# EAGLE design GPS_radiologger_v20_CAM_M8Q_Programmer (EAGLE 9.6.2)
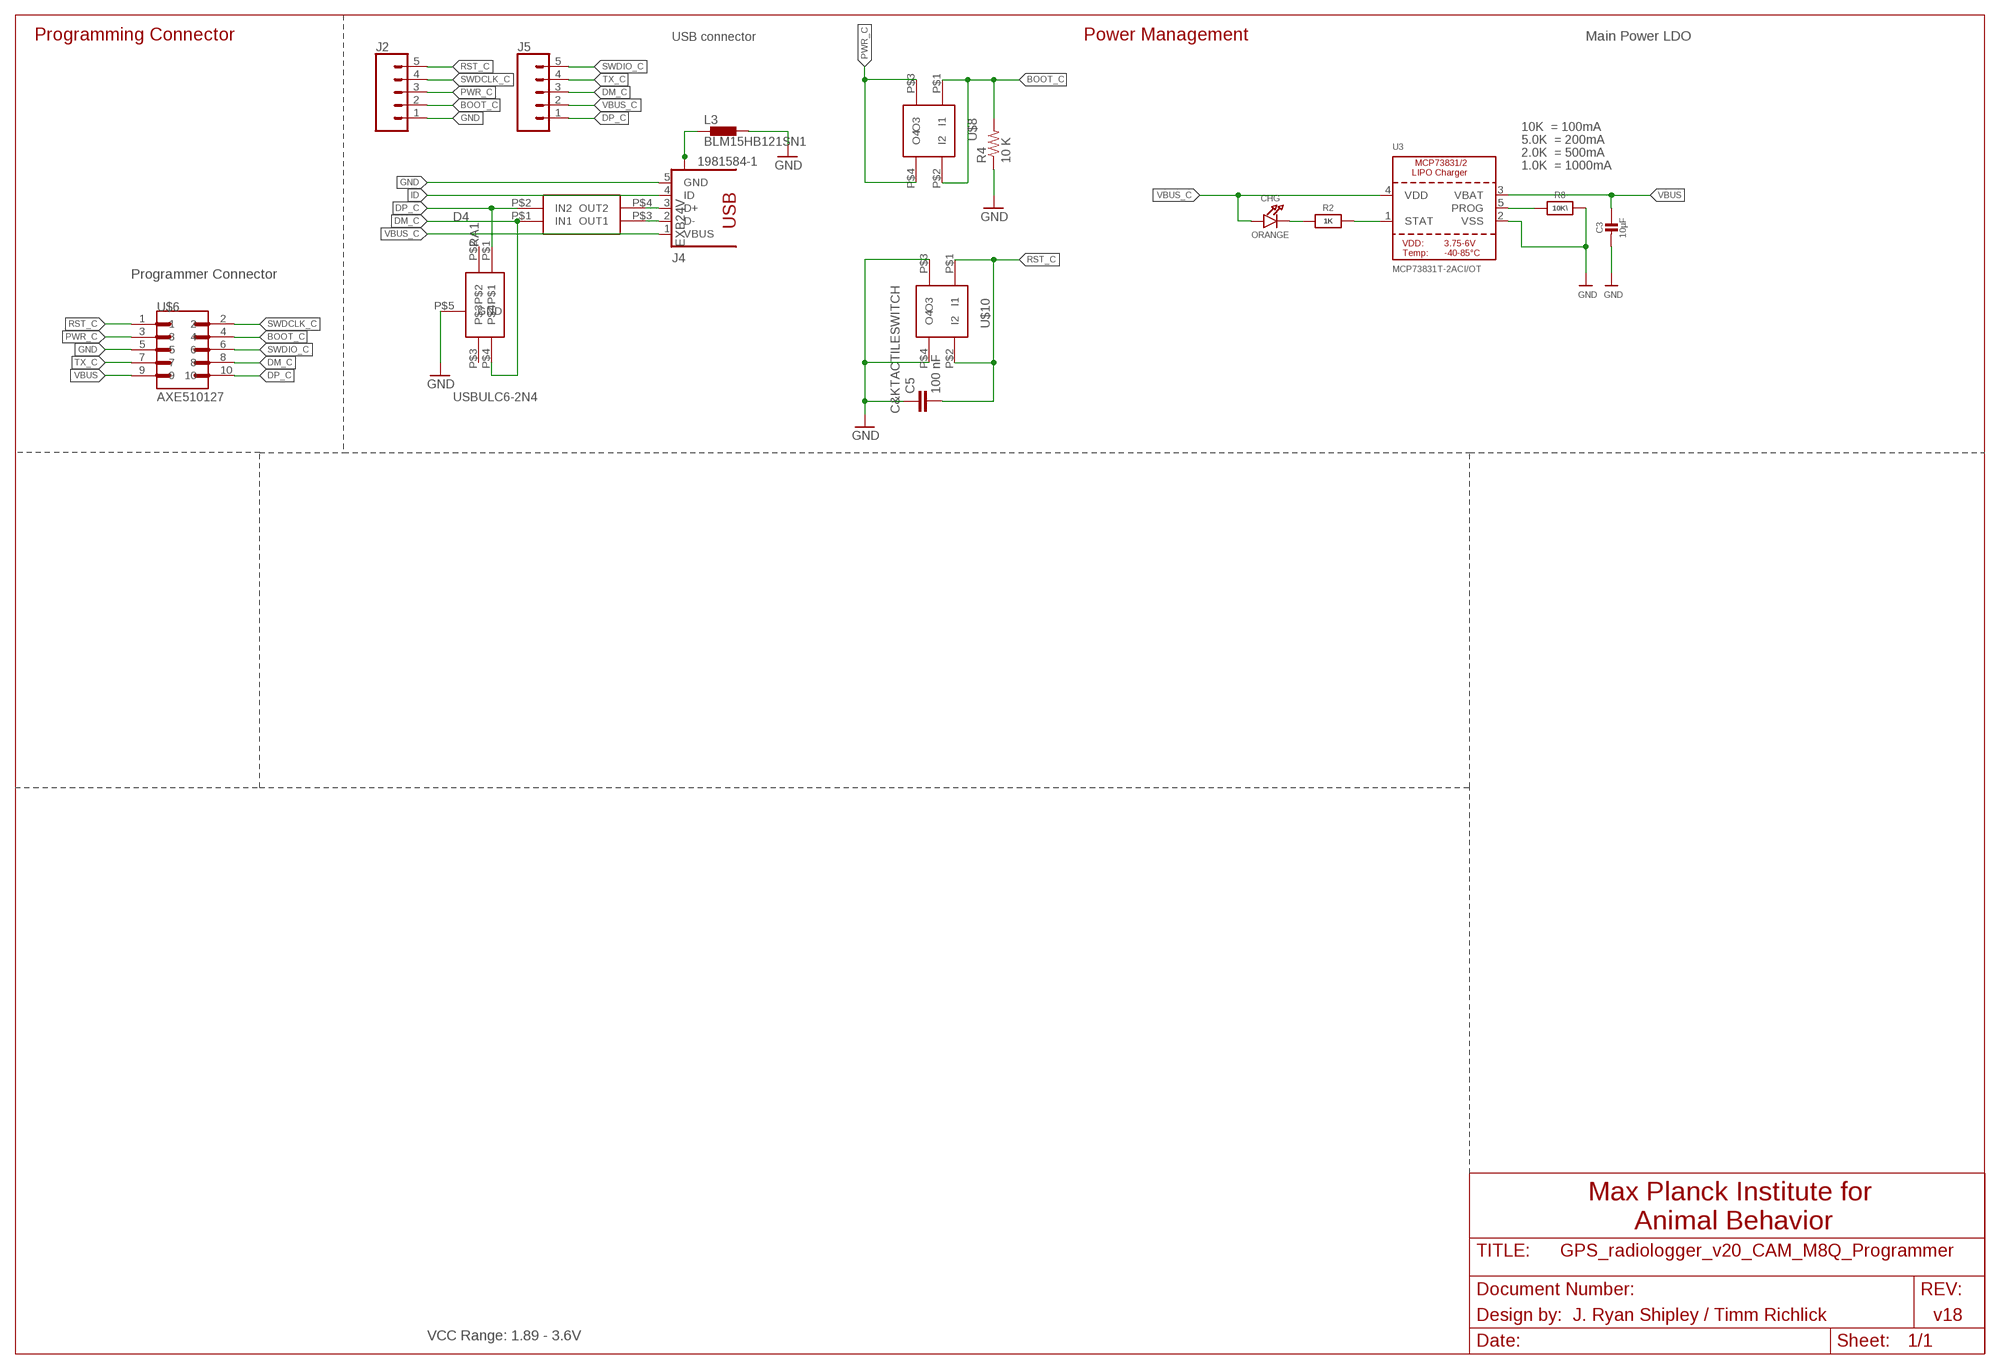
[diagram p0: schematic, sheet 1]

## Parts
C3  10µF  CAP_CERAMIC0805-NOOUTLINE  [0805-NO]
C5  100 nF  0402CAP.KW  [0402-CAP]
CHG  ORANGE  LED0805_NOOUTLINE  [CHIPLED_0805_NOOUTLINE]
D4  USBULC6-2N4  [USBULC6-2N4]
J2  CONN_05  [1X05]
J4  1981584-1  [1981584-1]
J5  CONN_05  [1X05]
L3  BLM15HB121SN1  [0402]
R2  1K  RESISTOR_0603_NOOUT  [0603-NO]
R4  10 K  0402RES.KW  [0402-RES]
R8  10K\  RESISTOR_0603_NOOUT  [0603-NO]
RA1  EXB24V  [EXB24V]
U3  MCP73831T-2ACI/OT  MCP73831/2  [SOT23-5]
U$6  AXE510127  [AXE510127]
U$8  C&KTACTILESWITCH  [C&KTACTILESWITCH]
U$10  C&KTACTILESWITCH  [C&KTACTILESWITCH]

## Nets
BOOT_C: J2.2 R4.2 U$6.4 U$8.P$1(I1) U$8.P$2(I2)
DM_C: D4.P$4 J5.3 RA1.P$1(IN1) U$6.8
DP_C: D4.P$1 J5.1 RA1.P$2(IN2) U$6.10
GND: C3.2 C5.1 D4.P$5(GND) J2.1 J4.5(GND) L3.2 R4.1 R8.2 U3.2(VSS) U$6.5 U$10.P$3(O3) U$10.P$4(O4)
ID: J4.4(ID)
N$1: CHG.C R2.1
N$3: R2.2 U3.1(STAT)
N$4: R8.1 U3.5(PROG)
N$31: J4.3(D+) RA1.P$4(OUT2)
N$33: J4.2(D-) RA1.P$3(OUT1)
PWR_C: J2.3 U$6.3 U$8.P$3(O3) U$8.P$4(O4)
RST_C: C5.2 J2.5 U$6.1 U$10.P$1(I1) U$10.P$2(I2)
SWDCLK_C: J2.4 U$6.2
SWDIO_C: J5.5 U$6.6
TX_C: J5.4 U$6.7
USB_SHIELD: J4.S1 J4.S2 J4.S3 J4.S4 L3.1
VBUS: C3.1 U3.3(VBAT) U$6.9
VBUS_C: CHG.A J4.1(VBUS) J5.2 U3.4(VDD)
Unconnected: D4.P$2 D4.P$3

## Notes on the sheet
- Programming Connector | USB connector | Power Management | Main Power LDO
- 10K  = 100mA
- 5.0K  = 200mA
- 2.0K  = 500mA
- 1.0K  = 1000mA
- Programmer Connector
- Max Planck Institute for 
  Animal Behavior
- Design by: | J. Ryan Shipley / Timm Richlick | v18
- VCC Range: 1.89 - 3.6V

## Library data of the parts
C3 = microbuilder:CAP_CERAMIC: Ceramic Capacitors For new designs, use the packages preceded by an '_' character since they are more reliable: The following footprints should be used on most boards: _0402 - Standard footprint for regular board layouts _0603 - Standard footprint for regular board layouts _0805 - Standard footprint for regular board layouts _1206 - Standard footprint for regular board layouts For extremely tight-pitch boards where space is at a premium, the following 'micro-pitch' footprints can be used (smaller pads, no silkscreen outline, etc.): _0402MP - Micro-pitch footprint for very dense/compact boards _0603MP - Micro-pitch footprint for very dense/compact boards _0805MP - Micro-pitch footprint for very dense/compact boards _1206MP - Micro-pitch footprint for very dense/compact boards
C5 = SparkFun-Capacitors:0402CAP.KW
CHG = microbuilder:LED: LED 0603 - 0603 Surface Mount Package 2mA: Green LED - Low Power (3.9mcd, 2ma, 1.7Vf) - Digikey: 475-2709-2-ND Orange LED - Low Power (9.8mcd, 2ma, 1.8Vf) - Digikey: 475-1194-2-ND Red LED - Low Power (5mcd, 2ma, 1.8Vf) - Digikey: 475-1195-2-ND Yellow LED - Low Power (7mcd, 2ma, 1.8Vf) - Digikey: 475-1196-2-ND 5mA: Blue LED - Low Power (17mcd, 5ma, 2.9Vf) - Digikey: LNJ937W8CRACT-ND 0805 - 0805 Surface Mount Package 2mA: Red LED (8.8mcd, 2mA, 1.8Vf, Clear) - Low Power [Digikey: 475-2510-1-ND] Green LED (5mcd, 2mA, 1.8Vf, Clear) - Low Power [Digikey: 475-2730-1-ND] Yellow LED (11.3mcd, 2mA, 1.8Vf, Clear) - Low Power [Digikey: 475-2555-1-ND] 20mA: Red LED (104mcd, 20mA, Diffused) - LS R976 [Digikey: 475-1278-6-ND] Red LED (12mcd, 20mA, 2.0Vf, Clear) - APT2012EC [Digikey: 754-1128-1-ND] Green LED (15mcd, 20mA, 2.2Vf, Clear) - APT2012GC [Digikey: 754-1131-1-ND] Orange LED (160mcd, 20mA, 2.1Vf, Clear) - APT2012SECK [Digikey: 754-1130-1-ND] 1206 - 1206 Surface Mount Package Green LED (26mcd, 20mA, Diffused) - LG N971 [Digikey: 475-1407-6-ND] Red LED (15mcd, 20mA, Diffused) - LH N974 [Digikey: 475-1416-6-ND] Cree - Cree High-Power Surface Mount LEDs XPEBWT-L1-0000-00D50 - White 111lm 350mA 2.9Vf 6200K 110° XTEAWT-00-0000-00000LEE3 - White 114lm 350mA 2.85Vf 5000K 115° Everlight - Everlight 45-21 Series Surface Mount LEDs 45-21/QK2C-B2832AC2CB2/2T - Warm White 2000mcd 20mA 3.25Vf 3050K 120° 45-21/LK2C-B38452C4CB2/2T - Nuetral White 2000mcd 20mA 3.25Vf 4150K 120° 45-21/LK2C-B50634C6CB2/2T - Cold White 2200mcd 20mA 3.25Vf 5650K 120° PLCC2 Reverse Mount LS T77K-J1L2-1-0-2-R18-Z - Red 11.25mcd 2mA 1.8Vf 630nm 120° LO T77K-L1M2-24-Z - Orange 19.6mcd 2mA 1.8Vf 606nm 120° LY T77K-K2M1-26-Z - Yellow 15.7mcd 2mA 1.8Vf 587nm 120°
D4 = Kris:USBULC6-2N4: ST TVS diode ESD Protection USBULC6-2N4
J2 J5 = SparkFun-Connectors:CONN_05: Multi connection point. Often used as Generic Header-pin footprint for 0.1 inch spaced/style header connections On any of the 0.1 inch spaced packages, you can populate with these: Break Away Headers - Straight <https://www.sparkfun.com/products/116> (PRT-00116) Break Away Male Headers - Right Angle <https://www.sparkfun.com/products/553> (PRT-00553) Female Headers <https://www.sparkfun.com/products/115> (PRT-00115) Break Away Headers - Machine Pin <https://www.sparkfun.com/products/117> (PRT-00117) Break Away Female Headers - Swiss Machine Pin <https://www.sparkfun.com/products/743> (PRT-00743) For SCREWTERMINALS and SPRING TERMINALS visit here: Screw Terimnals on SparkFun.com <https://www.sparkfun.com/search/results?term=Screw+Terminals> (5mm/3.5mm/2.54mm spacing) This device is also useful as a general connection point to wire up your design to another part of your project. Our various solder wires solder well into these plated through hole pads. Hook-Up Wire - Assortment (Stranded, 22 AWG) <https://www.sparkfun.com/products/11375> (PRT-11375) Hook-Up Wire - Assortment (Solid Core, 22 AWG) <https://www.sparkfun.com/products/11367> (PRT-11367) View the entire wire category on our website here <https://www.sparkfun.com/categories/141> Special notes: Molex polarized connector foot print use with SKU : PRT-08231 with associated crimp pins and housings. 1MM SMD Version SKU: PRT-10208
J4 = con-usb:1981584-1: Receptacle, micro-USB, type A/B Tyco Electronics; MF: Hirose; MPN: ZX62-AB-5PA(11)
L3 = inductors:BLM15H: EMIFIL (R) Chip Ferrite Bead for GHz Noise Source: http://www.murata.com/ Ferrite Bead BLM15H.pdf
R2 R8 = microbuilder:RESISTOR: Resistors For new designs, use the packages preceded by an '_' character since they are more reliable: The following footprints should be used on most boards: _0402 - Standard footprint for regular board layouts _0603 - Standard footprint for regular board layouts _0805 - Standard footprint for regular board layouts _1206 - Standard footprint for regular board layouts For extremely tight-pitch boards where space is at a premium, the following 'micro-pitch' footprints can be used (smaller pads, no silkscreen outline, etc.): _0402MP - Micro-pitch footprint for very dense/compact boards _0603MP - Micro-pitch footprint for very dense/compact boards _0805MP - Micro-pitch footprint for very dense/compact boards _1206MP - Micro-pitch footprint for very dense/compact boards
R4 = SparkFun-Resistors:0402RES.KW
RA1 = Kris:EXB24V: Panasonic EXB24 22 Ohm series resistor pair
U3 = microbuilder:MCP73831/2: MCP73831/2 LIPO Charger VDD: 3.75 - 6V Temp -40 - 85°C Programmable Charge Rate: 15-500mA NOTE: STAT is a tri-state logic output on the MCP73831 and an open-drain output on the MCP73832. SOT23-5 with 4.2V output and tri-state logic on STAT = MCP73831T-2ACI/OT
U$6 = PanasonicA4SConnectorsV7:AXE510127
U$8 U$10 = Kris:C&KTACTILESWITCH: C&K Tactile Switch 611-PTS810SJS250SMTR

## Net classes
0 default: width 0.152 mm, clearance 0.152 mm
1 power: width 0.152 mm, clearance 0.152 mm
2 antenna: width 0.152 mm, clearance 0.152 mm
3 battery: width 0.152 mm, clearance 0.152 mm

## Board
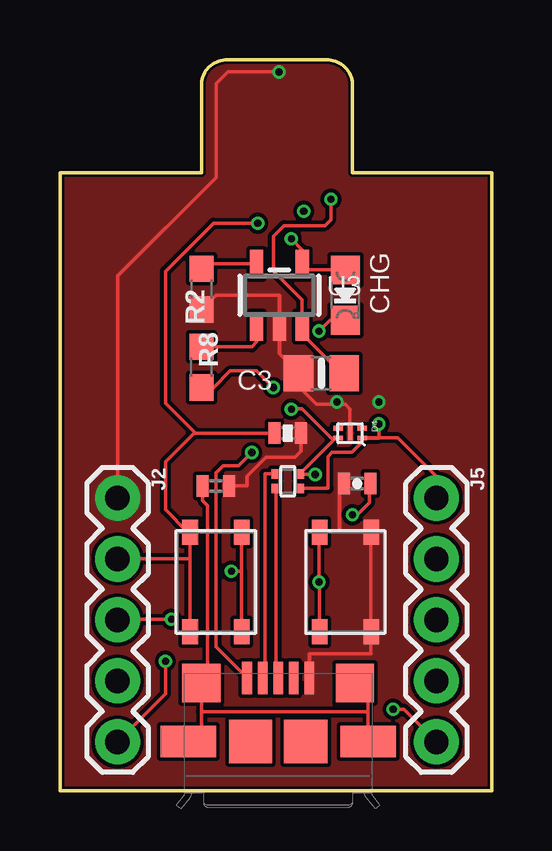
[diagram p1: board, top side]
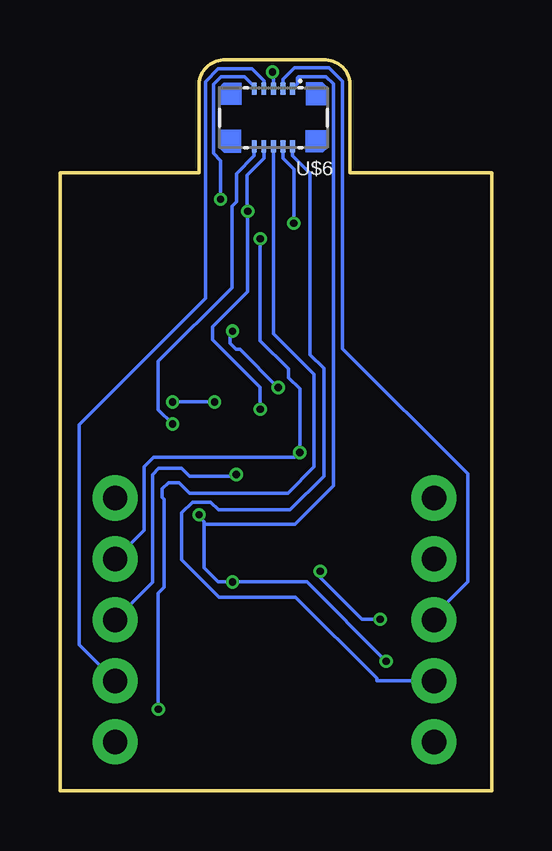
[diagram p2: board, bottom side, seen from below]

Size 18 x 30.45 mm. Coordinates in mm from the lower left corner, seen from the top.
Outline: 18,0 0,0 0,25.75 5.9,25.75 5.9,29.35 arc-90 6.9,30.45 11.2,30.45 arc-90 12.2,29.35 12.2,25.75 18,25.75 18,0
Copper layers (1*16): Top 0.035mm / dielectric 0.73mm / Bottom 0.035mm
Design rules "default *": minimum track width 5mil, minimum drill 0.2mm, track to track 5mil, track to pad 5mil, pad to pad 5mil, via to via 5mil, smd to smd 5mil, copper to edge 4mil, drill to drill 4mil, minimum pad ring 10mil, minimum via ring 5mil, stop-mask expansion 0mil, vias tented up to drill 20mil, thermal gap 0mil

### Footprints (pad centres in the part's own frame; a part is rotated, then mirrored left to right if it is on the bottom)
0805-NO = smd 1.24 x 1.5: 1 -0.95,0; 2 0.95,0
0402-CAP = smd 0.5 x 0.9: 1 -0.55,0; 2 0.55,0
CHIPLED_0805_NOOUTLINE = smd 1.2 x 1.2: A 0,-1.05; C 0,1.05
USBULC6-2N4 = smd 0.2 x 0.4: P$1 0.2,0.5; P$2 -0.2,0.5; P$3 -0.2,-0.5; P$4 0.2,-0.5 | smd 0.6 x 0.2: P$5 0,0
1X05 = drill 1.016 pad 1.88: 1 0,0; 2 2.54,0; 3 5.08,0; 4 7.62,0; 5 10.16,0
1981584-1 = smd 0.4 x 1.35: 1 -1.3,4.1; 2 -0.65,4.1; 3 0,4.1; 4 0.65,4.1; 5 1.3,4.1 | smd 1.8 x 1.8: M1 -1.15,1.45; M2 1.15,1.45 | smd 2.3 x 1.3: S1 -3.75,1.45; S2 3.75,1.45 | smd 1.6 x 1.6: S3 -3.2,3.885; S4 3.2,3.885
0402 = smd 0.5 x 0.9: 1 -0.55,0; 2 0.55,0
0603-NO = smd 1.1 x 1: 1 -0.85,0; 2 0.85,0
0402-RES = smd 0.5 x 0.9: 1 -0.55,0; 2 0.55,0
EXB24V = smd 0.4 x 0.36: P$1 -0.3,0.5; P$2 0.3,0.5; P$3 -0.3,-0.5; P$4 0.3,-0.5
SOT23-5 = smd 0.55 x 1.2: 1 -0.95,-1.3; 2 0,-1.3; 3 0.95,-1.3; 4 0.95,1.3; 5 -0.95,1.3
AXE510127 = smd 0.2 x 0.5: 1 -0.8,-1.2; 2 -0.8,1.2; 3 -0.4,-1.2; 4 -0.4,1.2; 5 0,-1.2; 6 0,1.2; 7 0.4,-1.2; 8 0.4,1.2; 9 0.8,-1.2; 10 0.8,1.2
C&KTACTILESWITCH = smd 1.05 x 0.65: P$1 -2.075,1.073; P$2 2.075,1.075; P$3 -2.075,-1.075; P$4 2.075,-1.075

### Placement (x,y rotation side)
C3  10.9,17.4 180 top
C5  12.4,12.8 0 top
CHG  11.9,20.65 180 top
D4  12.1,14.9 270 top
J2  2.4,12.2 270 top
J4  9.1,0.6 0 top
J5  15.7,12.2 270 top
L3  6.5,12.7 0 top
R2  5.9,17.65 90 top
R4  9.5,14.9 180 top
R8  5.9,20.9 270 top
RA1  9.5,12.9 270 top
U3  9.15,20.65 0 top
U$6  9.1,28.05 180 bottom
U$8  6.5,8.7 90 top
U$10  11.9,8.7 90 top

### Tracks (layer width: path | path; a pad name or v marks a point on that pad's centre or on a via)
BOOT_C  (via drill 0.3)
  Top 0.152: U$8.P$1 U$8.P$2 | U$8.P$2 5.43,9.66 J2.2 | U$8.P$2 5.33,10.78 4.4,11.7 4.4,13.7 5.6,14.9 | 5.6,14.9 R4.2 | 5.6,14.9 5.6,14.95 4.4,16.15 4.4,21.65 6.4,23.65 v8.25,23.65
  Bottom 0.152: U$6.4 8.7,26.35 8.25,25.9 v8.25,23.65
DM_C  (via drill 0.3)
  Top 0.152: v10.65,13.18 10.02,13.18 RA1.P$1 11.5,14.7 D4.P$4 11.32,14.7 10.1,15.91 9.66,15.91 v9.65,15.9
  Bottom 0.152: U$6.8 9.5,26.35 10.2,25.65 10.2,24.18 v10.17,24.15 10.17,20.8 11.63,19.33 11.63,18.79 9.65,16.8 v9.65,15.9 | J5.3 14.13,8.69 14.13,13.18 13.88,13.43 12.92,13.43 12.59,13.1 10.73,13.1 v10.65,13.18
DP_C  (via drill 0.3)
  Top 0.152: RA1.P$2 11.18,12.6 11.18,13.93 11.35,14.1 12.18,14.1 12.6,14.51 D4.P$1 | J5.1 15.7,13.1 14.1,14.7 D4.P$1 | v13.3,15.28 13.3,14.7 D4.P$1
  Bottom 0.152: U$6.10 9.9,26.45 10.63,25.72 10.63,24.55 10.83,24.35 10.83,20.97 13.9,17.9 13.9,15.88 v13.3,15.28
GND  (via drill 0.3)
  Top 0.152: J4.5 10.4,5.7 12.97,5.7 U$10.P$3 U$10.P$4 12.97,10.8 11.65,10.8 11.65,12.6 C5.1 | R4.1 10.05,14.15 9.8,13.9 8.6,13.9 7.8,13.1 7.8,12.7 L3.2 | D4.P$5 12.1,15.9 11.9,16.1 11.55,16.1 | 11.55,16.1 v11.55,16.2 | R8.2 6.5,20.65 9.15,20.65 U3.2 9.15,18.2 C3.2 10.18,17.17 10.18,16.62 10.7,16.1 11.55,16.1 | v9.13,29.95 7,29.95 6.5,29.45 6.5,25.55 2.4,21.45 J2.1
  Bottom 0.152: v11.55,16.2 v13.3,16.2 | 9.1,29.95 v9.13,29.95 9.1,29.92 U$6.5
  pour Top: 18.1,-0.3 -0.3,-0.3 -0.3,31.15 18.1,31.15
N$1  (via drill 0.3)
  Top 0.152: R2.1 6.4,16.8 7.1,17.5 8.2,17.5 v8.9,16.8 | v10.8,19.15 11.25,19.6 CHG.C
  Bottom 0.152: v8.9,16.8 10.5,18.4 10.65,18.4 10.9,18.65 10.9,19.06 v10.8,19.15
N$3
  Top 0.152: U3.1 8.2,18.7 8,18.5 R2.2
N$4
  Top 0.152: U3.5 6.1,21.95 R8.1
N$31
  Top 0.152: J4.3 9,4.8 RA1.P$4
N$33
  Top 0.152: J4.2 8.55,4.8 8.55,13.2 RA1.P$3
PWR_C  (via drill 0.3)
  Top 0.152: J2.3 2.43,7.15 v4.65,7.15 | v7.15,9.15 7.58,9.15 | 7.58,9.15 U$8.P$3 | 7.58,9.15 U$8.P$4
  Bottom 0.152: U$6.3 8.7,29.64 8.22,30.13 6.78,30.13 6.22,29.57 6.22,18.42 1,13.2 1,8.7 2.4,7.3 J2.3 | v4.65,7.15 5.4,7.15 7.15,8.9 v7.15,9.15
RST_C  (via drill 0.3)
  Top 0.152: J2.5 4.4,4.04 v4.4,5.4 | U$10.P$2 10.8,10.75 v10.8,8.7 10.83,8.67 U$10.P$1 | C5.2 12.9,12.75 12.9,12 12.4,11.5 v12.2,11.5
  Bottom 0.152: v4.4,5.4 7.7,8.7 v10.8,8.7 11.4,8.7 12,9.3 12,11.1 | v12.2,11.5 12.2,11.4 12,11.2 12,11.1 | 12,11.1 8.21,11.1 6.6,12.71 6.6,29.45 6.9,29.75 8.05,29.75 8.1,29.7 8.1,29.45 U$6.1
SWDCLK_C
  Bottom 0.152: U$6.2 8.3,26.46 7.57,25.73 7.57,18.17 7,17.6 7,13.11 8.41,11.7 11.39,11.7 11.72,12.03 12.48,12.03 12.93,11.58 12.93,9.63 11.37,8.07 8.17,8.07 4.78,4.68 4.78,4.58 J2.4
SWDIO_C  (via drill 0.3)
  Top 0.152: J5.5 14.34,3.4 v13.9,3.4
  Bottom 0.152: v13.9,3.4 13.9,8.22 13.65,8.47 13.65,12.14 13.73,12.22 13.73,12.58 13.48,12.83 13.02,12.83 12.59,12.4 8.5,12.4 7.4,13.5 7.4,17.35 9.1,19.05 U$6.6
TX_C
  Bottom 0.152: U$6.7 9.5,29.58 10,30.08 11.4,30.08 11.93,29.55 11.93,20.52 17.2,15.25 17.2,6.08 J5.4
USB_SHIELD
  Top 0.152: J4.S4 12.85,4.49 12.85,3.3 | 12.85,3.3 J4.S2 | 5.9,3.3 J4.S3 6.16,4.74 6.16,11.88 5.95,12.09 L3.1 | 5.9,3.3 5.9,2.05 J4.S1 | 5.9,3.3 12.85,3.3
VBUS  (via drill 0.3)
  Top 0.152: C3.1 11.75,17.4 10.1,19.05 U3.3 10.1,20.45 8.9,21.65 8.9,23.1 9.35,23.55 11.05,23.55 11.3,23.8 v11.3,24.65
  Bottom 0.152: v11.3,24.65 11.3,26.26 11.6,26.57 11.6,29.43 11.28,29.75 10.3,29.75 9.9,29.35 U$6.9
VBUS_C  (via drill 0.3)
  Top 0.152: J4.1 6.5,6 6.5,13.25 6.8,13.55 7.45,13.55 v8,14.1 | CHG.A 10.35,21.7 U3.4 10.1,22.55 v9.65,23
  Bottom 0.152: J5.2 14.5,10.86 14.5,13.5 14.1,13.9 8.2,13.9 v8,14.1 8,16.75 8.47,17.22 8.47,17.58 9.65,18.76 v9.65,23